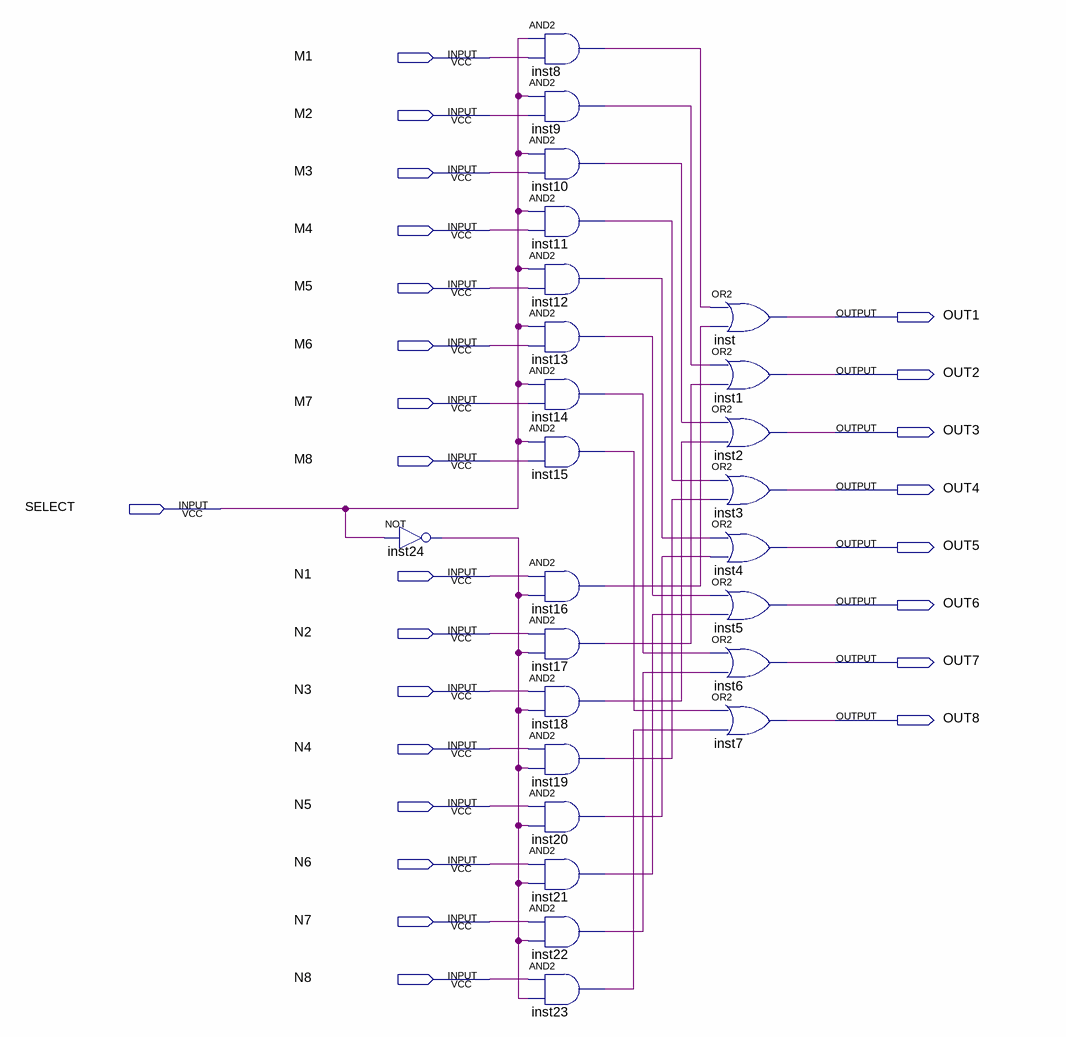
[diagram p0: schematic sheet]
// Quartus schematic SELECT-TWO.bdf as structural Verilog: 25 symbols, 25 pins
module \SELECT-TWO  (
  input  M1,
  input  M2,
  input  M3,
  input  M4,
  input  M5,
  input  M6,
  input  M7,
  input  M8,
  input  SELECT,
  input  N1,
  input  N2,
  input  N3,
  input  N4,
  input  N5,
  input  N6,
  input  N7,
  input  N8,
  output OUT1,
  output OUT2,
  output OUT3,
  output OUT4,
  output OUT5,
  output OUT6,
  output OUT7,
  output OUT8
);

  wire inst8_out, inst9_out, inst10_out, inst11_out, inst12_out, inst13_out, inst14_out, inst15_out,
       inst16_out, inst17_out, inst18_out, inst19_out, inst20_out, inst21_out, inst22_out, inst23_out,
       inst24_out;

  not inst24 (inst24_out, SELECT);
  and inst8 (inst8_out, SELECT, M1);
  and inst9 (inst9_out, SELECT, M2);
  and inst10 (inst10_out, SELECT, M3);
  and inst11 (inst11_out, SELECT, M4);
  and inst12 (inst12_out, SELECT, M5);
  and inst13 (inst13_out, SELECT, M6);
  and inst14 (inst14_out, SELECT, M7);
  and inst15 (inst15_out, SELECT, M8);
  and inst16 (inst16_out, N1, inst24_out);
  and inst17 (inst17_out, N2, inst24_out);
  and inst18 (inst18_out, N3, inst24_out);
  and inst19 (inst19_out, N4, inst24_out);
  and inst20 (inst20_out, N5, inst24_out);
  and inst21 (inst21_out, N6, inst24_out);
  and inst22 (inst22_out, N7, inst24_out);
  and inst23 (inst23_out, N8, inst24_out);
  or inst (OUT1, inst8_out, inst16_out);
  or inst1 (OUT2, inst9_out, inst17_out);
  or inst2 (OUT3, inst10_out, inst18_out);
  or inst3 (OUT4, inst11_out, inst19_out);
  or inst4 (OUT5, inst12_out, inst20_out);
  or inst5 (OUT6, inst13_out, inst21_out);
  or inst6 (OUT7, inst14_out, inst22_out);
  or inst7 (OUT8, inst15_out, inst23_out);
endmodule
